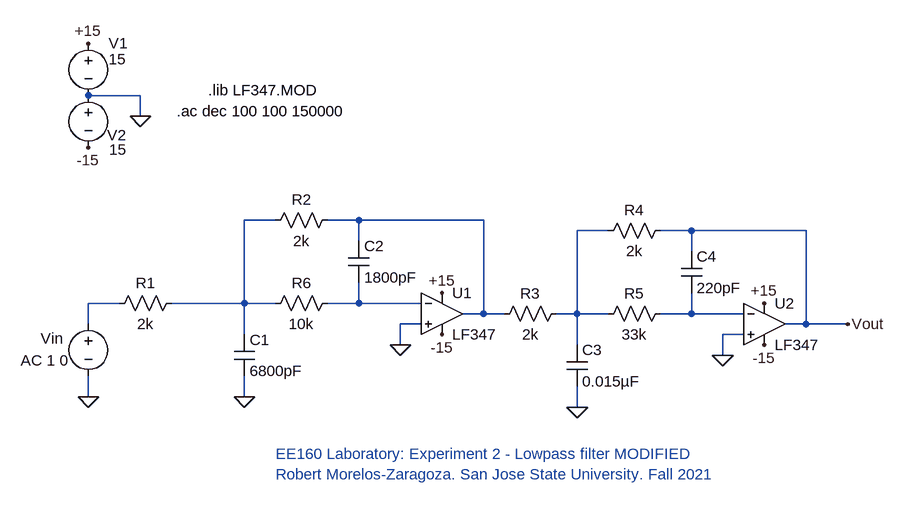
[diagram p0: schematic exp2_LPF_modified.asc]
exp2_LPF_modified.asc, the LTspice schematic file:
Version 4
SHEET 1 880 680
WIRE -784 -944 -864 -944
WIRE -784 -912 -784 -944
WIRE -576 -752 -624 -752
WIRE -448 -752 -496 -752
WIRE -256 -752 -448 -752
WIRE -64 -736 -112 -736
WIRE 64 -736 16 -736
WIRE 240 -736 64 -736
WIRE -448 -720 -448 -752
WIRE 64 -704 64 -736
WIRE -816 -624 -864 -624
WIRE -624 -624 -624 -752
WIRE -624 -624 -736 -624
WIRE -576 -624 -624 -624
WIRE -448 -624 -448 -656
WIRE -448 -624 -496 -624
WIRE -352 -624 -448 -624
WIRE -256 -608 -256 -752
WIRE -256 -608 -288 -608
WIRE -224 -608 -256 -608
WIRE -112 -608 -112 -736
WIRE -112 -608 -144 -608
WIRE -64 -608 -112 -608
WIRE 64 -608 64 -640
WIRE 64 -608 16 -608
WIRE 144 -608 64 -608
WIRE -864 -592 -864 -624
WIRE -352 -592 -384 -592
WIRE 240 -592 240 -736
WIRE 240 -592 208 -592
WIRE 304 -592 240 -592
WIRE -624 -576 -624 -624
WIRE 144 -576 112 -576
WIRE -384 -560 -384 -592
WIRE -112 -560 -112 -608
WIRE 112 -544 112 -576
WIRE -864 -480 -864 -512
WIRE -624 -480 -624 -512
WIRE -112 -464 -112 -496
FLAG -784 -912 0
FLAG -864 -1024 +15
FLAG -864 -864 -15
FLAG -320 -640 +15
FLAG -320 -576 -15
FLAG -864 -480 0
FLAG -384 -560 0
FLAG -624 -480 0
FLAG 176 -624 +15
FLAG 176 -560 -15
FLAG 112 -544 0
FLAG -112 -464 0
FLAG 304 -592 Vout
SYMBOL Opamps\\opamp2 -320 -672 R0
SYMATTR InstName U1
SYMATTR Value LF347
SYMBOL voltage -864 -1040 R0
WINDOW 0 31 15 Left 2
WINDOW 3 31 40 Left 2
WINDOW 123 0 0 Left 2
WINDOW 39 0 0 Left 2
SYMATTR InstName V1
SYMATTR Value 15
SYMBOL voltage -864 -960 R0
WINDOW 0 29 77 Left 2
WINDOW 3 32 99 Left 2
WINDOW 123 0 0 Left 2
WINDOW 39 0 0 Left 2
SYMATTR InstName V2
SYMATTR Value 15
SYMBOL voltage -864 -608 R0
WINDOW 123 -104 72 Left 2
WINDOW 39 0 0 Left 2
WINDOW 0 -73 38 Left 2
SYMATTR Value2 AC 1 0
SYMATTR InstName Vin
SYMATTR Value ""
SYMBOL res -832 -608 R270
WINDOW 0 32 56 VTop 2
WINDOW 3 0 56 VBottom 2
SYMATTR InstName R1
SYMATTR Value 2k
SYMBOL cap -640 -576 R0
SYMATTR InstName C1
SYMATTR Value 6800pF
SYMBOL res -592 -736 R270
WINDOW 0 32 56 VTop 2
WINDOW 3 0 56 VBottom 2
SYMATTR InstName R2
SYMATTR Value 2k
SYMBOL res -592 -608 R270
WINDOW 0 32 56 VTop 2
WINDOW 3 0 56 VBottom 2
SYMATTR InstName R6
SYMATTR Value 10k
SYMBOL cap -464 -720 R0
SYMATTR InstName C2
SYMATTR Value 1800pF
SYMBOL Opamps\\opamp2 176 -656 R0
SYMATTR InstName U2
SYMATTR Value LF347
SYMBOL res -240 -592 R270
WINDOW 0 32 56 VTop 2
WINDOW 3 0 56 VBottom 2
SYMATTR InstName R3
SYMATTR Value 2k
SYMBOL cap -128 -560 R0
SYMATTR InstName C3
SYMATTR Value 0.015µF
SYMBOL res -80 -720 R270
WINDOW 0 32 56 VTop 2
WINDOW 3 0 56 VBottom 2
SYMATTR InstName R4
SYMATTR Value 2k
SYMBOL res -80 -592 R270
WINDOW 0 32 56 VTop 2
WINDOW 3 0 56 VBottom 2
SYMATTR InstName R5
SYMATTR Value 33k
SYMBOL cap 48 -704 R0
SYMATTR InstName C4
SYMATTR Value 220pF
TEXT -680 -952 Left 2 !.lib LF347.MOD
TEXT -728 -920 Left 2 !.ac dec 100 100 150000
TEXT -576 -392 Left 2 ;EE160 Laboratory: Experiment 2 - Lowpass filter MODIFIED\nRobert Morelos-Zaragoza. San Jose State University. Fall 2021

The netlist it stands for:
* exp2_LPF_modified.asc
XU1 0 N005 +15 -15 N002 LF347  ; pins In+ In- V+ V- OUT
V1 +15 0 15
V2 0 -15 15
Vin N004 0 AC 1 0
R1 N004 N001 2k
C1 N001 0 6800pF
R2 N001 N002 2k
R6 N001 N005 10k
C2 N002 N005 1800pF
XU2 0 N006 +15 -15 Vout LF347  ; pins In+ In- V+ V- OUT
R3 N002 N003 2k
C3 N003 0 0.015µF
R4 N003 Vout 2k
R5 N003 N006 33k
C4 Vout N006 220pF
.lib LF347.MOD
.ac dec 100 100 150000
* EE160 Laboratory: Experiment 2 - Lowpass filter MODIFIED
* Robert Morelos-Zaragoza. San Jose State University. Fall 2021
.backanno
.end